# EAGLE design dsp (EAGLE 7.2.0)
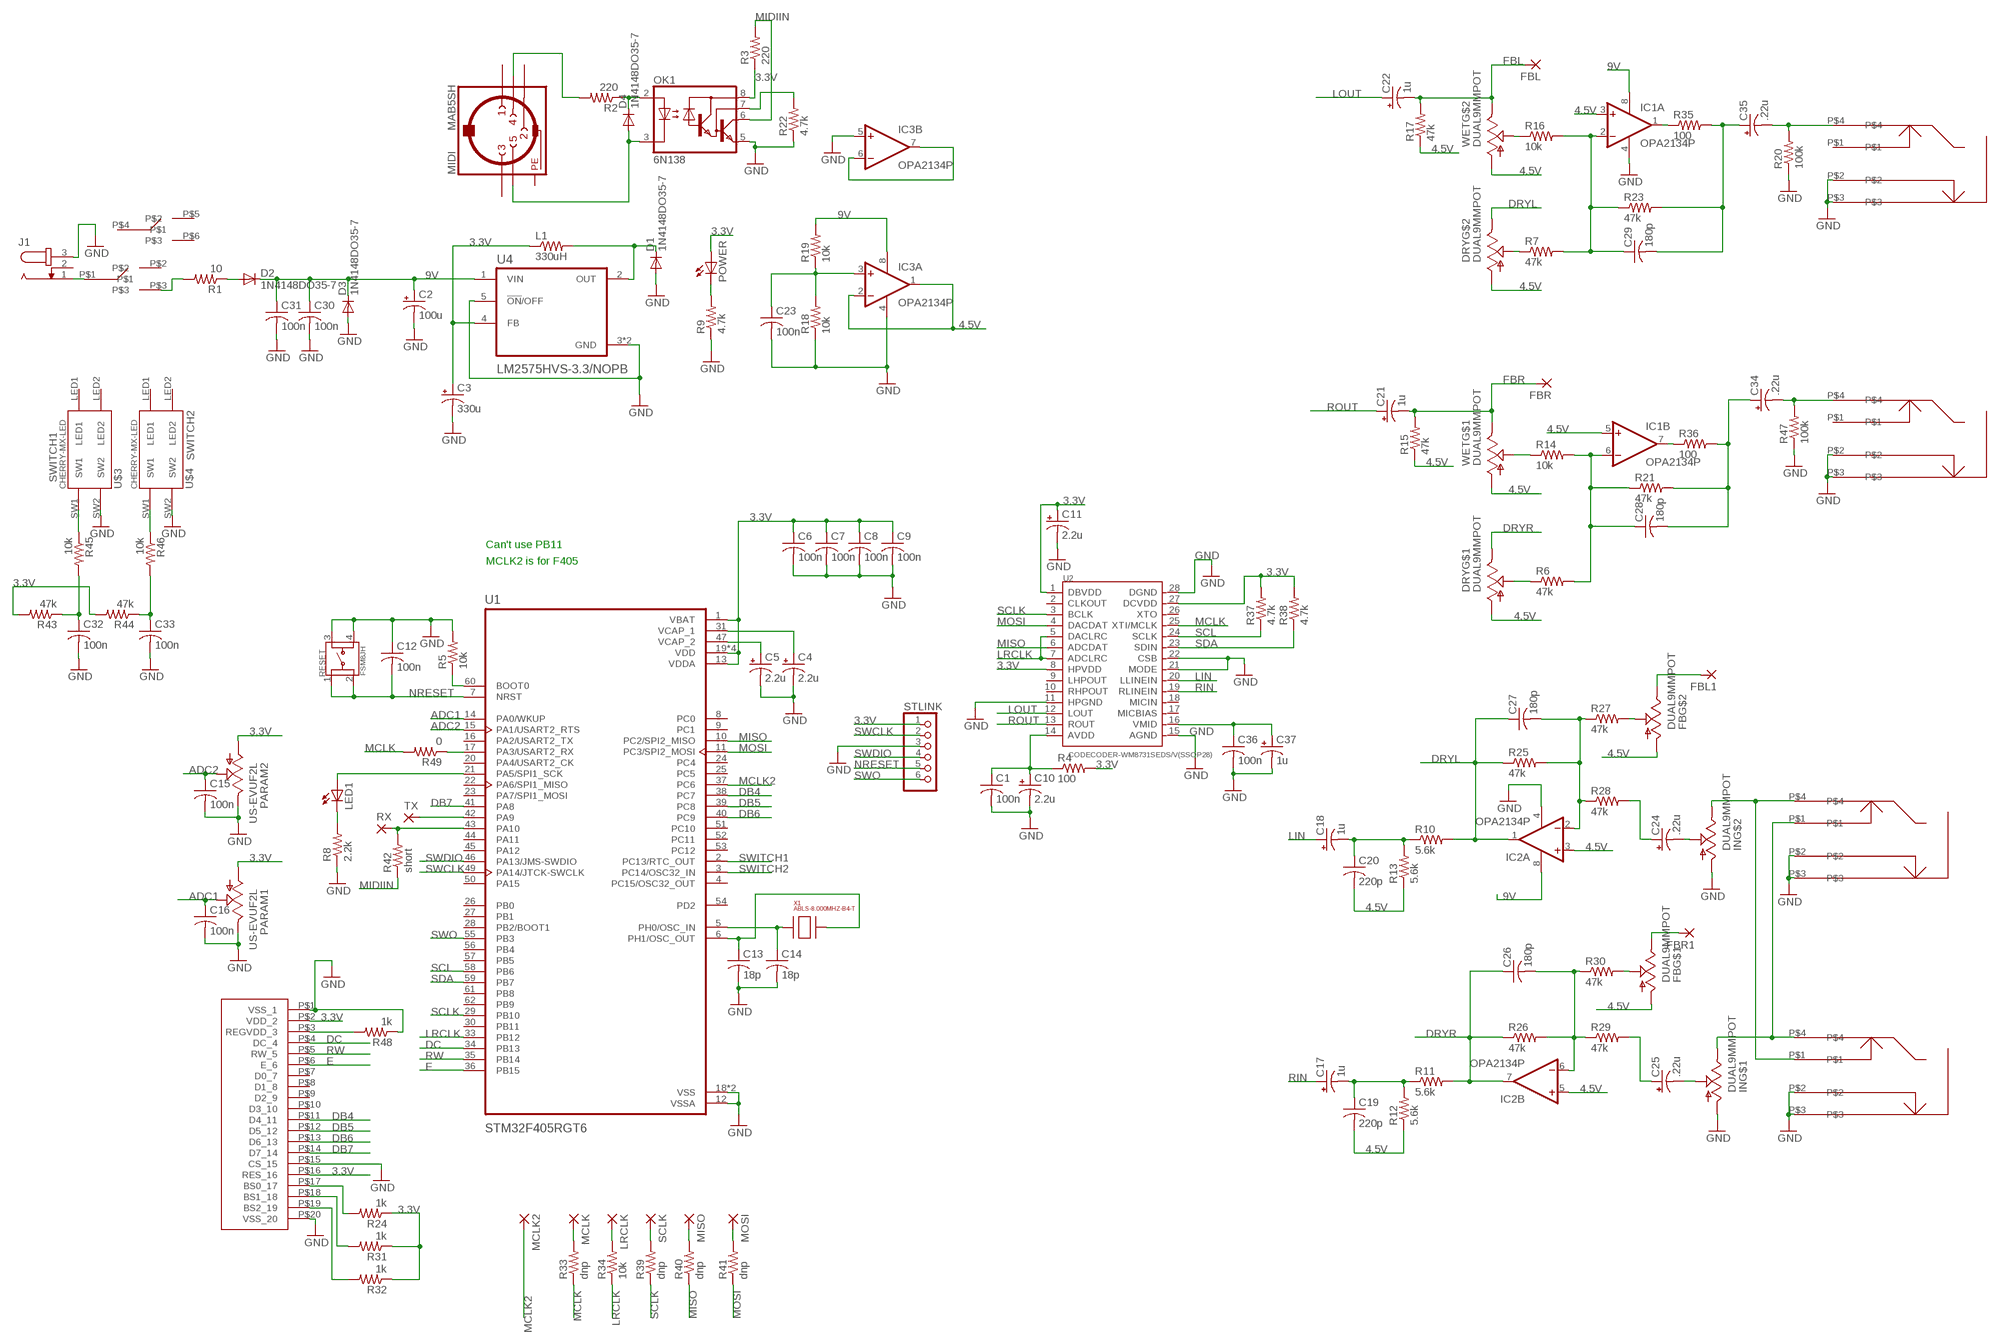
[diagram p0: schematic, sheet 1]

## Parts
C1  100n  C-US050-025X075  [C050-025X075]
C2  100u  CPOL-USE2.5-7  [E2,5-7]
C3  330u  CPOL-USE3.5-8  [E3,5-8]
C4  2.2u  CPOL-USE2-4  [E2-4]
C5  2.2u  CPOL-USE2-4  [E2-4]
C6  100n  C-US050-025X075  [C050-025X075]
C7  100n  C-US050-025X075  [C050-025X075]
C8  100n  C-US050-025X075  [C050-025X075]
C9  100n  C-US050-025X075  [C050-025X075]
C10  2.2u  CPOL-USE2-5  [E2-5]
C11  2.2u  CPOL-USE2-4  [E2-4]
C12  100n  C-US050-025X075  [C050-025X075]
C13  18p  C-USC0603  [C0603]
C14  18p  C-USC0603  [C0603]
C15  100n  C-US050-025X075  [C050-025X075]
C16  100n  C-US050-025X075  [C050-025X075]
C17  1u  CPOL-USE2.5-7  [E2,5-7]
C18  1u  CPOL-USE2.5-7  [E2,5-7]
C19  220p  C-US050-025X075  [C050-025X075]
C20  220p  C-US050-025X075  [C050-025X075]
C21  1u  CPOL-USE2.5-7  [E2,5-7]
C22  1u  CPOL-USE2.5-7  [E2,5-7]
C23  100n  C-US050-025X075  [C050-025X075]
C24  .22u  CPOL-USE2.5-7  [E2,5-7]
C25  .22u  CPOL-USE2.5-7  [E2,5-7]
C26  180p  C-US050-025X075  [C050-025X075]
C27  180p  C-US050-025X075  [C050-025X075]
C28  180p  C-US050-025X075  [C050-025X075]
C29  180p  C-US050-025X075  [C050-025X075]
C30  100n  C-US050-025X075  [C050-025X075]
C31  100n  C-US050-025X075  [C050-025X075]
C32  100n  C-US050-025X075  [C050-025X075]
C33  100n  C-US050-025X075  [C050-025X075]
C34  .22u  CPOL-USE2.5-7  [E2,5-7]
C35  .22u  CPOL-USE2.5-7  [E2,5-7]
C36  100n  C-US050-025X075  [C050-025X075]
C37  1u  CPOL-USE2-4  [E2-4]
D1  1N4148DO35-7  [DO35-7]
D2  1N4148DO35-7  [DO35-7]
D3  1N4148DO35-7  [DO35-7]
D4  1N4148DO35-7  [DO35-7]
DRY  DUAL9MMPOT  [DUAL9MMPOT]
FB  DUAL9MMPOT  [DUAL9MMPOT]
FBL  2,0/0,9-S  [2,0/0,9-S]
FBL1  2,0/0,9-S  [2,0/0,9-S]
FBR  2,0/0,9-S  [2,0/0,9-S]
FBR1  2,0/0,9-S  [2,0/0,9-S]
IC1  OPA2134P  [DIL08]
IC2  OPA2134P  [DIL08]
IC3  OPA2134P  [DIL08]
IN  DUAL9MMPOT  [DUAL9MMPOT]
INL  NMJ4HCD2  [NMJ4HCD2]
INR  NMJ4HCD2  [NMJ4HCD2]
J1  JACK-PLUG0  [SPC4077]
L1  330uH  R-US_0207/7  [0207/7]
LED1  LED5MM  [LED5MM]
LRCLK  2,0/0,9-S  [2,0/0,9-S]
MCLK  2,0/0,9-S  [2,0/0,9-S]
MCLK2  2,0/0,9-S  [2,0/0,9-S]
MIDI  MAB5SH  [MAB5SH]
MISO  2,0/0,9-S  [2,0/0,9-S]
MOSI  2,0/0,9-S  [2,0/0,9-S]
OK1  6N138  [DIL08]
OUTL  NMJ4HCD2  [NMJ4HCD2]
OUTR  NMJ4HCD2  [NMJ4HCD2]
PARAM1  US-EVUF2L  [EVUFXL]
PARAM2  US-EVUF2L  [EVUFXL]
POWER  LED5MM  [LED5MM]
R1  10  R-US_0309/V  [0309V]
R2  220  R-US_0309/V  [0309V]
R3  220  R-US_0309/V  [0309V]
R4  100  R-US_0309/V  [0309V]
R5  10k  R-US_R0603  [R0603]
R6  47k  R-US_0309/V  [0309V]
R7  47k  R-US_0309/V  [0309V]
R8  2.2k  R-US_0309/V  [0309V]
R9  4.7k  R-US_0309/V  [0309V]
R10  5.6k  R-US_0309/V  [0309V]
R11  5.6k  R-US_0309/V  [0309V]
R12  5.6k  R-US_0309/V  [0309V]
R13  5.6k  R-US_0309/V  [0309V]
R14  10k  R-US_0309/V  [0309V]
R15  47k  R-US_0309/V  [0309V]
R16  10k  R-US_0309/V  [0309V]
R17  47k  R-US_0309/V  [0309V]
R18  10k  R-US_0309/V  [0309V]
R19  10k  R-US_0309/V  [0309V]
R20  100k  R-US_0309/V  [0309V]
R21  47k  R-US_0309/V  [0309V]
R22  4.7k  R-US_0309/V  [0309V]
R23  47k  R-US_0309/V  [0309V]
R24  1k  R-US_0309/V  [0309V]
R25  47k  R-US_0309/V  [0309V]
R26  47k  R-US_0309/V  [0309V]
R27  47k  R-US_0309/V  [0309V]
R28  47k  R-US_0309/V  [0309V]
R29  47k  R-US_0309/V  [0309V]
R30  47k  R-US_0309/V  [0309V]
R31  1k  R-US_0309/V  [0309V]
R32  1k  R-US_0309/V  [0309V]
R33  dnp  R-US_R0603  [R0603]
R34  10k  R-US_R0603  [R0603]
R35  100  R-US_0309/V  [0309V]
R36  100  R-US_0309/V  [0309V]
R37  4.7k  R-US_R0603  [R0603]
R38  4.7k  R-US_R0603  [R0603]
R39  dnp  R-US_R0603  [R0603]
R40  dnp  R-US_R0603  [R0603]
R41  dnp  R-US_R0603  [R0603]
R42  short  R-US_0309/V  [0309V]
R43  47k  R-US_0309/V  [0309V]
R44  47k  R-US_0309/V  [0309V]
R45  10k  R-US_0309/V  [0309V]
R46  10k  R-US_0309/V  [0309V]
R47  100k  R-US_0309/V  [0309V]
R48  1k  R-US_0309/V  [0309V]
R49  0  R-US_R0603  [R0603]
RESET  FSM8JH  [SW_FSM8JH]
RX  2,0/0,9-S  [2,0/0,9-S]
SCLK  2,0/0,9-S  [2,0/0,9-S]
STLINK  PINHD-1X6  [1X06]
TX  2,0/0,9-S  [2,0/0,9-S]
U1  STM32F405RGT6  [QFP50P1200X1200X160-64N]
U2  CODECODER-WM8731SEDS/V(SSOP28)  [SSOP28-0.65-10.2X5.2MM]
U4  LM2575HVS-3.3/NOPB  [VREG_TPS79625KTTR]
U$1  NHD-0420CW  [NHD-0420CW]
U$2  LC2255  [LC2255]
U$3  CHERRY-MX-LED  [CHERRY-MX-LED]
U$4  CHERRY-MX-LED  [CHERRY-MX-LED]
WET  DUAL9MMPOT  [DUAL9MMPOT]
X1  ABLS-8.000MHZ-B4-T  [HC-49/US]

## Nets
3.3V: C3.+ C6.1 C7.1 C8.1 C9.1 C11.+ L1.1 OK1.8(VCC) PARAM1.1(A) PARAM2.1(A) POWER.A R3.1 R4.2 R24.1 R31.1 R32.1 R37.2 R38.2 R43.2 R44.2 STLINK.1 U1.1(VBAT) U1.13(VDDA) U1.19(VDD) U1.32(VDD) U1.48(VDD) U1.64(VDD) U2.1(DBVDD) U2.8(HPVDD) U2.27(DCVDD) U4.4(FB) U$1.P$2(VDD_2) U$1.P$16(RES_16)
4.5V: C19.2 C20.2 DRY.1(A) DRY.4(A) FB.1(A) FB.4(A) IC1.3(A:+IN) IC1.5(B:+IN) IC2.3(A:+IN) IC2.5(B:+IN) IC3.1(A:OUT) IC3.2(A:-IN) R12.1 R13.1 R15.1 R17.1 WET.1(A) WET.4(A)
9V: C2.+ C30.1 C31.1 D2.C D3.C IC1.8(P:V+) IC2.8(P:V+) IC3.8(P:V+) R19.2 U4.1(VIN)
ADC1: C16.1 PARAM1.2(S) U1.14(PA0/WKUP)
ADC2: C15.1 PARAM2.2(S) U1.15(PA1/USART2_RTS)
DB4: U1.38(PC7) U$1.P$11(D4_11)
DB5: U1.39(PC8) U$1.P$12(D5_12)
DB6: U1.40(PC9) U$1.P$13(D6_13)
DB7: U1.41(PA8) U$1.P$14(D7_14)
DC: U1.34(PB13) U$1.P$4(DC_4)
DRYL: C27.1 DRY.6(E) IC2.1(A:OUT) R10.2 R25.1
DRYR: C26.1 DRY.3(E) IC2.7(B:OUT) R11.2 R26.1
E: U1.36(PB15) U$1.P$6(E_6)
FBL: C22.- FBL.1(P) R17.2 WET.6(E)
FBR: C21.- FBR.1(P) R15.2 WET.3(E)
GND: C1.2 C2.- C3.- C4.- C5.- C6.2 C7.2 C8.2 C9.2 C10.- C11.- C12.1 C13.2 C14.2 C15.2 C16.2 C23.2 C30.2 C31.2 C32.2 C33.2 C36.2 C37.- D1.A D3.A IC1.4(P:V-) IC2.4(P:V-) IC3.4(P:V-) IC3.5(B:+IN) IN.1(A) IN.4(A) INL.P$2 INL.P$3 INR.P$2 INR.P$3 J1.3 OK1.5(GND) OUTL.P$2 OUTL.P$3 OUTR.P$2 OUTR.P$3 PARAM1.3(E) PARAM2.3(E) R5.2 R8.1 R9.1 R18.1 R20.1 R22.1 R47.1 R48.1 RESET.3 RESET.4 STLINK.3 U1.12(VSSA) U1.18(VSS) U1.63(VSS) U2.11(HPGND) U2.15(AGND) U2.21(MODE) U2.22(CSB) U2.28(DGND) U4.3(GND) U4.5(!ON!/OFF) U4.6(GND) U$1.P$1(VSS_1) U$1.P$15(CS_15) U$1.P$20(VSS_20) U$3.SW2 U$4.SW2
LIN: C18.+ U2.20(LLINEIN)
LOUT: C22.+ U2.12(LOUT)
LRCLK: R34.1 U1.33(PB12) U2.5(DACLRC) U2.7(ADCLRC)
MCLK: R33.1 R49.2 U2.25(XTI/MCLK)
MCLK2: MCLK2.1(P) U1.37(PC6)
MIDIIN: OK1.6(VO) R3.2 R42.1
MISO: R40.1 U1.10(PC2/SPI2_MISO) U2.6(ADCDAT)
MOSI: R41.1 U1.11(PC3/SPI2_MOSI) U2.4(DACDAT)
N$1: C4.+ U1.31(VCAP_1)
N$2: C5.+ U1.47(VCAP_2)
N$3: D2.A R1.1
N$4: D1.C L1.2 U4.2(OUT)
N$5: C1.1 C10.+ R4.1 U2.14(AVDD)
N$6: R1.2 U$2.P$3
N$7: R5.1 U1.60(BOOT0)
N$8: TX.1(P) U1.42(PA9)
N$9: LED1.A U1.21(PA5/SPI1_SCK)
N$10: LED1.K(C) R8.2
N$11: POWER.K(C) R9.2
N$12: C13.1 U1.6(PH1/OSC_OUT) X1.P$2
N$13: C14.1 U1.5(PH0/OSC_IN) X1.P$1
N$14: FB.2(S) R30.2
N$15: C17.- C19.1 R11.1 R12.2
N$16: FB.5(S) R27.2
N$17: C18.- C20.1 R10.1 R13.2
N$18: C29.1 IC1.2(A:-IN) R7.2 R16.2 R23.1
N$19: C28.1 IC1.6(B:-IN) R6.2 R14.2 R21.1
N$20: C23.1 IC3.3(A:+IN) R18.2 R19.1
N$21: R14.1 WET.2(S)
N$22: R16.1 WET.5(S)
N$23: C28.2 C34.+ R21.2 R36.2
N$24: C29.2 C35.+ R23.2 R35.2
N$25: R49.1 U1.17(PA3/USART2_RX)
N$26: C24.+ R28.2
N$27: C27.2 IC2.2(A:-IN) R25.2 R27.1 R28.1
N$28: C26.2 IC2.6(B:-IN) R26.2 R29.1 R30.1
N$29: IN.3(E) INL.P$1 INR.P$4
N$30: C25.+ R29.2
N$31: IC1.7(B:OUT) R36.1
N$32: IC1.1(A:OUT) R35.1
N$33: C24.- IN.5(S)
N$34: C25.- IN.2(S)
N$35: DRY.2(S) R6.1
N$36: DRY.5(S) R7.1
N$37: J1.1 U$2.P$1
N$38: OK1.7(VB) R22.2
N$39: D4.C OK1.2(A) R2.1
N$40: MIDI.4 R2.2
N$41: D4.A MIDI.5 OK1.3(C)
N$42: R32.2 U$1.P$19(BS2_19)
N$43: R31.2 U$1.P$18(BS1_18)
N$44: R24.2 U$1.P$17(BS0_17)
N$45: MCLK.1(P) R33.2
N$46: LRCLK.1(P) R34.2
N$47: R39.2 SCLK.1(P)
N$48: MISO.1(P) R40.2
N$49: MOSI.1(P) R41.2
N$50: R42.2 RX.1(P) U1.43(PA10)
N$51: R45.1 U$3.SW1
N$52: R46.1 U$4.SW1
N$53: C35.- OUTL.P$4 R20.2
N$54: C34.- OUTR.P$4 R47.2
N$55: FB.6(E) FBL1.1(P)
N$56: FB.3(E) FBR1.1(P)
N$57: C36.1 C37.+ U2.16(VMID)
N$58: IN.6(E) INL.P$4 INR.P$1
N$59: R48.2 U$1.P$3(REGVDD_3)
N$60: IC3.6(B:-IN) IC3.7(B:OUT)
NRESET: C12.2 RESET.1 RESET.2 STLINK.5 U1.7(NRST)
RIN: C17.+ U2.19(RLINEIN)
ROUT: C21.+ U2.13(ROUT)
RW: U1.35(PB14) U$1.P$5(RW_5)
SCL: R37.1 U1.58(PB6) U2.24(SCLK)
SCLK: R39.1 U1.29(PB10) U2.3(BCLK)
SDA: R38.1 U1.59(PB7) U2.23(SDIN)
SWCLK: STLINK.2 U1.49(PA14/JTCK-SWCLK)
SWDIO: STLINK.4 U1.46(PA13/JMS-SWDIO)
SWITCH1: C32.1 R43.1 R45.2 U1.2(PC13/RTC_OUT)
SWITCH2: C33.1 R44.1 R46.2 U1.3(PC14/OSC32_IN)
SWO: STLINK.6 U1.55(PB3)
Unconnected: J1.2 MIDI.1 MIDI.2 MIDI.3 OUTL.P$1 OUTR.P$1 U1.4(PC15/OSC32_OUT) U1.8(PC0) U1.9(PC1) U1.16(PA2/USART2_TX) U1.20(PA4/USART2_CK) U1.22(PA6/SPI1_MISO) U1.23(PA7/SPI1_MOSI) U1.24(PC4) U1.25(PC5) U1.26(PB0) U1.27(PB1) U1.28(PB2/BOOT1) U1.30(PB11) U1.44(PA11) U1.45(PA12) U1.50(PA15) U1.51(PC10) U1.52(PC11) U1.53(PC12) U1.54(PD2) U1.56(PB4) U1.57(PB5) U1.61(PB8) U1.62(PB9) U2.2(CLKOUT) U2.9(LHPOUT) U2.10(RHPOUT) U2.17(MICBIAS) U2.18(MICIN) U2.26(XTO) U$1.P$7(D0_7) U$1.P$8(D1_8) U$1.P$9(D2_9) U$1.P$10(D3_10) U$2.P$2 U$2.P$4 U$2.P$5 U$2.P$6 U$3.LED1 U$3.LED2 U$4.LED1 U$4.LED2

## Notes on the sheet
- Can't use PB11
- MCLK2 is for F405

## Power pins joined to a net without a drawn wire
PE: MIDI.PE MIDI.PE@(PE)

## Library data of the parts
C1 C6-C9 C12-C16 C19 C20 C23 C26-C33 C36 = dan:C-US: CAPACITOR, American symbol
C2-C5 C10 C11 C17 C18 C21 C22 C24 C25 C34 C35 C37 = dan:CPOL-US: POLARIZED CAPACITOR, American symbol
D1-D4 = dan:1N4148: DIODE high speed (Philips)
DRY FB IN WET = dan:DUAL9MMPOT
FBL FBL1 FBR FBR1 LRCLK MCLK MCLK2 MISO MOSI RX SCLK TX = synthdiy:2,0/0,9-S: SQUARE THROUGH-HOLE PAD 2.0 mm, 0.9 mm/0.079",0.035"
IC1-IC3 = dan:OPA2134: SoundPLUS (TM) High Performance AUDIO OPERATIONAL AMPLIFIERS Source: http://focus.ti.com/lit/ds/sbos058/sbos058.pdf
INL INR OUTL OUTR = dan:NMJ4HCD2
J1 = dan:JACK-PLUG: DC POWER JACK Power Jack, DC, Right Angle, Through Hole, Rated 5A at 16VDC, PC Terminals Distributor: Farnell (www.Farnell.de) Drawing: 84N1161.pdf / 84N1162.pdf Manufacturer: SPC Technology (www.spctechnology.com) Type: SPC4077 / SPC 4078; OC_FARNELL: unknown; OC_NEWARK: unknown
L1 R1-R49 = dan:R-US_: RESISTOR, American symbol
LED1 POWER = dan:LED: LED OSRAM: - CHIPLED LG R971, LG N971, LY N971, LG Q971, LY Q971, LO R971, LY R971 LH N974, LH R974 LS Q976, LO Q976, LY Q976 LO Q996 - Hyper CHIPLED LW Q18S LB Q993, LB Q99A, LB R99A - SideLED LS A670, LO A670, LY A670, LG A670, LP A670 LB A673, LV A673, LT A673, LW A673 LH A674 LY A675 LS A676, LA A676, LO A676, LY A676, LW A676 LS A679, LY A679, LG A679 - Hyper Micro SIDELED® LS Y876, LA Y876, LO Y876, LY Y876 LT Y87S - SmartLED LW L88C, LW L88S LB L89C, LB L89S, LG L890 LS L89K, LO L89K, LY L89K LS L896, LA L896, LO L896, LY L896 - TOPLED LS T670, LO T670, LY T670, LG T670, LP T670 LSG T670, LSP T670, LSY T670, LOP T670, LYG T670 LG T671, LOG T671, LSG T671 LB T673, LV T673, LT T673, LW T673 LH T674 LS T676, LA T676, LO T676, LY T676, LB T676, LH T676, LSB T676, LW T676 LB T67C, LV T67C, LT T67C, LS T67K, LO T67K, LY T67K, LW E67C LS E67B, LA E67B, LO E67B, LY E67B, LB E67C, LV E67C, LT E67C LW T67C LS T679, LY T679, LG T679 LS T770, LO T770, LY T770, LG T770, LP T770 LB T773, LV T773, LT T773, LW T773 LH T774 LS E675, LA E675, LY E675, LS T675 LS T776, LA T776, LO T776, LY T776, LB T776 LHGB T686 LT T68C, LB T68C - Hyper Mini TOPLED® LB M676 - Mini TOPLED Santana® LG M470 LS M47K, LO M47K, LY M47K Source: http://www.osram.convergy.de LUXEON: - LUMILED® LXK2-PW12-R00, LXK2-PW12-S00, LXK2-PW14-U00, LXK2-PW14-V00 LXK2-PM12-R00, LXK2-PM12-S00, LXK2-PM14-U00 LXK2-PE12-Q00, LXK2-PE12-R00, LXK2-PE12-S00, LXK2-PE14-T00, LXK2-PE14-U00 LXK2-PB12-K00, LXK2-PB12-L00, LXK2-PB12-M00, LXK2-PB14-N00, LXK2-PB14-P00, LXK2-PB14-Q00 LXK2-PR12-L00, LXK2-PR12-M00, LXK2-PR14-Q00, LXK2-PR14-R00 LXK2-PD12-Q00, LXK2-PD12-R00, LXK2-PD12-S00 LXK2-PH12-R00, LXK2-PH12-S00 LXK2-PL12-P00, LXK2-PL12-Q00, LXK2-PL12-R00 Source: www.luxeon.com KINGBRIGHT: KA-3528ASYC Source: www.kingbright.com
MIDI = dan:MAB5SH: Female CONNECTOR 5 pins 90 deg. with shield, horizontal (DIN 41524); OC_FARNELL: 809883; OC_NEWARK: unknown
OK1 = dan:6N138: MOTOROLA OPTO COUPLER; MF: VISHAY/TELEFUNKEN; MPN: 6N138; OC_FARNELL: 9860150; OC_NEWARK: 35K5294
PARAM1 PARAM2 = dan:US-EVU: 9 mm Square Rotary Potentiometers Source: Panasonic
RESET = FSM8JH:FSM8JH: Switch, Pushbutton, Tactile, SPST, Thru Hole, Vertical, 6MM, Black Check prices <https://pricing.snapeda.com/parts/FSM8JH/TE%20Connectivity/view-part?ref=eda>; AVAILABILITY: Warning; DESCRIPTION: Tactile Switch SPST-NO Top Actuated Through Hole; MF: TE Connectivity; MP: FSM8JH; PACKAGE: None; PRICE: None
STLINK = dan:PINHD-1X6: PIN HEADER
U1 = STM32F405RGT6:STM32F405RGT6: High-performance foundation line, ARM Cortex-M4 core with DSP and FPU, 1 Mbyte Flash, 168 MHz CPU, ART Accelerator Check prices <https://pricing.snapeda.com/parts/STM32F405RGT6/STMicroelectronics/view-part?ref=eda>; AVAILABILITY: Good; DESCRIPTION: ARM® Cortex®-M4 STM32F4 Microcontroller IC 32-Bit 168MHz 1MB (1M x 8) FLASH 64-LQFP (10x10); MF: STMicroelectronics; MP: STM32F405RGT6; PACKAGE: LQFP-64 STMicroelectronics; PRICE: None; PURCHASE-URL: https://pricing.snapeda.com/search/part/STM32F405RGT6/?ref=eda
U2 = CODECODER-WM8731SEDS_V_SSOP28_:CODECODER-WM8731SEDS/V(SSOP28): 310080003 Check prices <https://pricing.snapeda.com/parts/WM8731SEDS/V/Cirrus%20Logic/view-part?ref=eda>; AVAILABILITY: Warning; DESCRIPTION: Audio Interface 24 b Serial 28-SSOP; MF: Cirrus Logic; MP: WM8731SEDS/V; PACKAGE: SSOP-28 Cirrus Logic; PRICE: None; PURCHASE-URL: https://pricing.snapeda.com/search/part/WM8731SEDS/V/?ref=eda
U4 = LM2575HVS-3.3_NOPB:LM2575HVS-3.3/NOPB: Check prices <https://pricing.snapeda.com/parts/LM2575HVS-3.3/NOPB/Texas%20Instruments/view-part?ref=eda>; AVAILABILITY: Good; DESCRIPTION: SIMPLE SWITCHER 1A Step-Down Voltage Regulator 5-DDPAK/TO-263 -40 to 125; MF: Texas Instruments; MP: LM2575HVS-3.3/NOPB; PACKAGE: TO-263-5 Texas Instruments; PRICE: None; PURCHASE-URL: https://pricing.snapeda.com/search/part/LM2575HVS-3.3/NOPB/?ref=eda
U$1 = dan:NHD-0420CW
U$2 = dan:LC2255
U$3 U$4 = dan:CHERRY-MX-LED: Cherry MX series keyswitch with LED
X1 = ABLS-8.000MHZ-B4-T:ABLS-8.000MHZ-B4-T: 8MHz ±30ppm Crystal 18pF 80 Ohms HC-49/US Check prices <https://pricing.snapeda.com/parts/ABLS-8.000MHZ-B4-T/Abracon%20LLC/view-part?ref=eda>; AVAILABILITY: Good; DESCRIPTION: 8MHz ±30ppm Crystal 18pF 80 Ohms HC-49/US; MF: Abracon LLC; MP: ABLS-8.000MHZ-B4-T; PACKAGE: HC-49/US Abracon LLC; PRICE: None; PURCHASE-URL: https://pricing.snapeda.com/search/part/ABLS-8.000MHZ-B4-T/?ref=eda

## Board
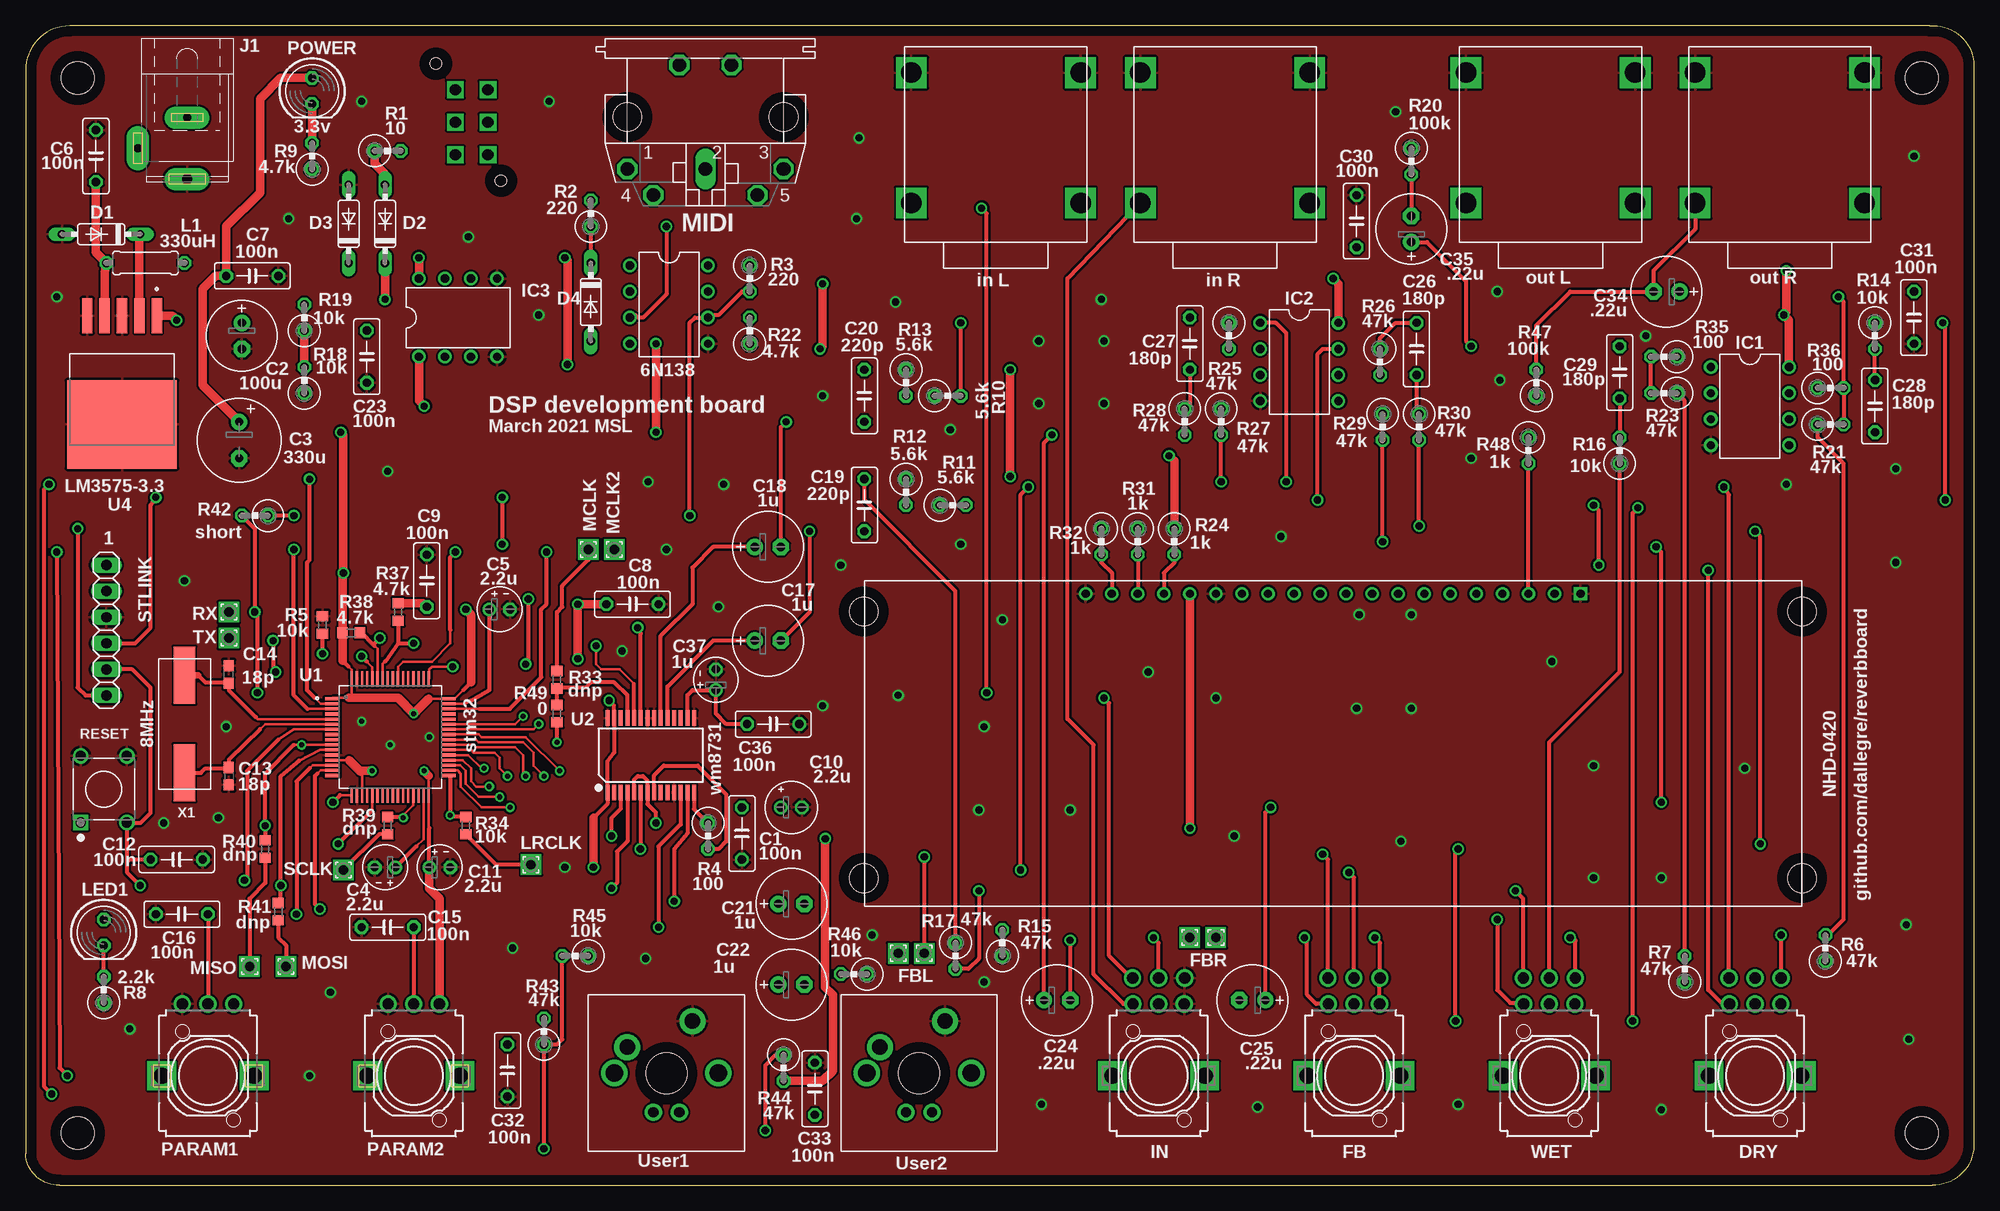
[diagram p1: board, top side]
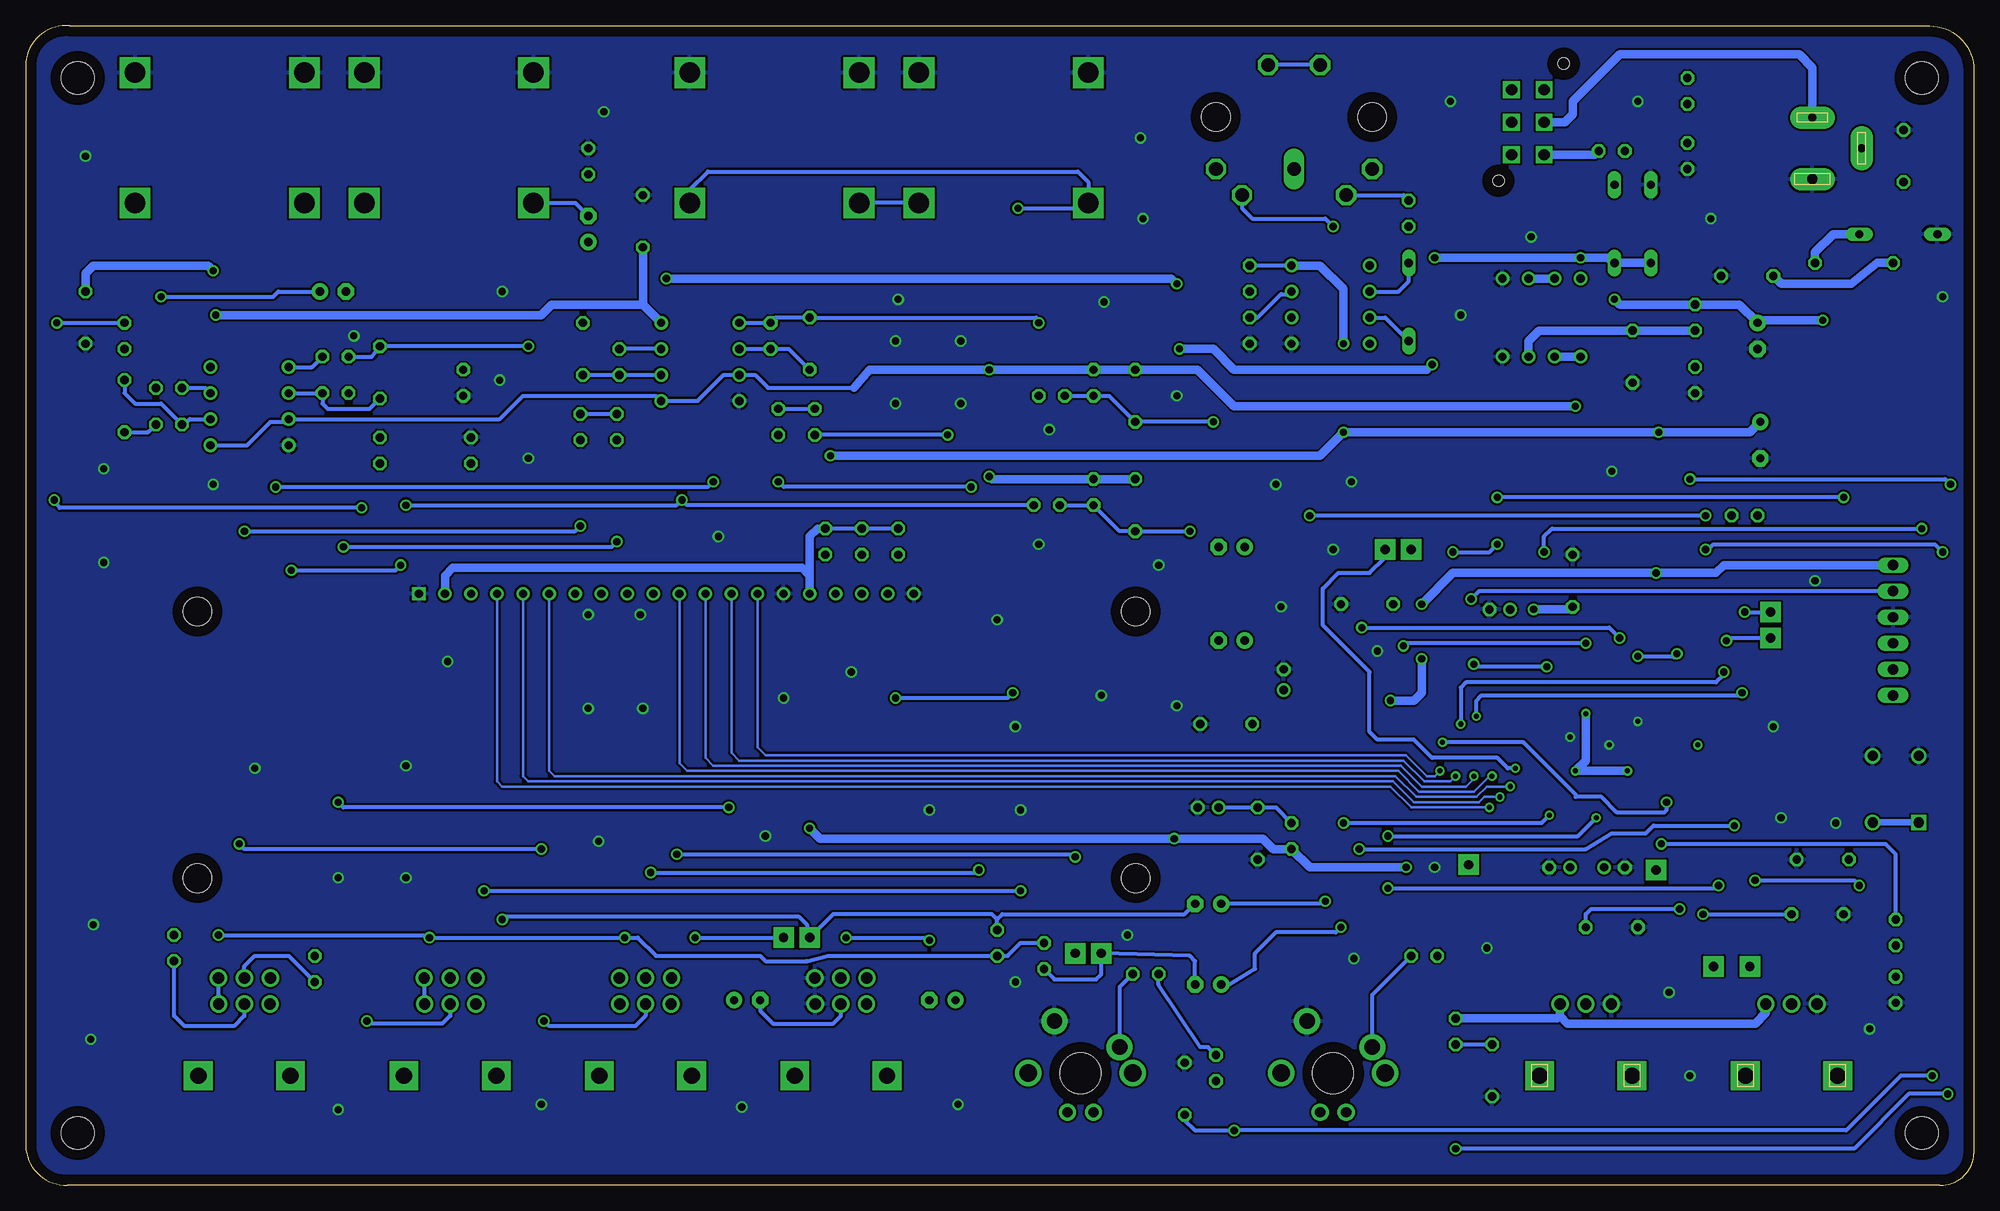
[diagram p2: board, bottom side, seen from below]

Size 189.99 x 113.05 mm. Coordinates in mm from the lower left corner, seen from the top.
Outline: 3.3,0 185.93,0 arc90 189.99,3.81 189.99,109.47 arc90 185.67,113.03 4.32,113.03 arc90 0,108.71 0,3.05 arc90 3.3,0
Copper layers (1*16): Top 0.035mm / dielectric 1.5mm / Bottom 0.035mm
Design rules "default *": minimum track width 10mil, minimum drill 10mil, track to track 8mil, track to pad 8mil, pad to pad 8mil, via to via 8mil, smd to smd 8mil, copper to edge 40mil, drill to drill 8mil, minimum pad ring 10mil, minimum via ring 8mil, stop-mask expansion 4mil, vias tented up to drill 0mil, thermal gap 10mil
Holes 3.2 mm at 5.08,107.95 5.08,5.08 184.91,5.08 184.91,107.95

### Footprints (pad centres in the part's own frame; a part is rotated, then mirrored left to right if it is on the bottom)
C050-025X075 = drill 0.813 octagon: 1 -2.54,0; 2 2.54,0
E2,5-7 = drill 0.813 pad 1.6: + -1.27,0 | drill 0.813 pad 1.6 octagon: - 1.27,0
E3,5-8 = drill 0.813 pad 1.6: + -1.778,0 | drill 0.813 pad 1.6 octagon: - 1.778,0
E2-4 = drill 0.813 pad 1.27: + -1.016,0 | drill 0.813 pad 1.27 octagon: - 1.016,0
E2-5 = drill 0.813 pad 1.27: + -1.016,0 | drill 0.813 pad 1.27 octagon: - 1.016,0
C0603 = smd 1.1 x 1: 1 -0.85,0; 2 0.85,0
DO35-7 = drill 0.813 long: A 3.81,0; C -3.81,0
DUAL9MMPOT = drill 1.1 pad 1.676: 1 -2.5,-7; 2 0,-7; 3 2.5,-7; 4 -2.54,-9.525; 5 0,-9.525; 6 2.54,-9.525 | drill 1.6 pad 2.8 square: M1 4.5,0; M2 -4.5,0
2,0/0,9-S = drill 0.914 pad 2 square: 1 0,0
DIL08 = drill 0.813 pad 1.27: 1 -3.81,-3.81; 2 -1.27,-3.81; 3 1.27,-3.81; 4 3.81,-3.81; 5 3.81,3.81; 6 1.27,3.81; 7 -1.27,3.81; 8 -3.81,3.81
NMJ4HCD2 = drill 2 square: P$1 0,0; P$2 12.7,0; P$3 12.7,16.51; P$4 0,16.51
SPC4077 = drill 0.8 pad 2.184 long: 1 -3,0; 2 0,-4.8 | drill 1 pad 2.184 long: 3 3,0
0207/7 = drill 0.813 octagon: 1 -3.81,0; 2 3.81,0
LED5MM = drill 0.813 octagon: A -1.27,0; K 1.27,0
MAB5SH = drill 1.321 octagon: 1 7.62,5.08; 3 -7.62,5.08; 4 5.08,7.62; 5 -5.08,7.62; PE -2.54,-5.08; PE@ 2.54,-5.08 | drill 1.321 long: 2 0,5.08 | hole 2.794: 7.62,0; -7.62,0
EVUFXL = drill 1.1 pad 1.676: 1 -2.5,-7; 2 0,-7; 3 2.5,-7 | drill 1.6 pad 2.8 square: M1 4.5,0; M2 -4.5,0
0309V = drill 0.813 octagon: 1 -1.27,0; 2 1.27,0
R0603 = smd 1 x 1.1: 1 -0.85,0; 2 0.85,0
SW_FSM8JH = drill 0.99 square: 1 -3.25,2.25 | drill 0.99: 2 -3.25,-2.25; 3 3.25,2.25; 4 3.25,-2.25
1X06 = drill 1.016 long: 1 -6.35,0; 2 -3.81,0; 3 -1.27,0; 4 1.27,0; 5 3.81,0; 6 6.35,0
QFP50P1200X1200X160-64N = smd 1.47 x 0.28: 1 -5.67,3.75; 2 -5.67,3.25; 3 -5.67,2.75; 4 -5.67,2.25; 5 -5.67,1.75; 6 -5.67,1.25; 7 -5.67,0.75; 8 -5.67,0.25; 9 -5.67,-0.25; 10 -5.67,-0.75; 11 -5.67,-1.25; 12 -5.67,-1.75; 13 -5.67,-2.25; 14 -5.67,-2.75; 15 -5.67,-3.25; 16 -5.67,-3.75; 33 5.67,-3.75; 34 5.67,-3.25; 35 5.67,-2.75; 36 5.67,-2.25; 37 5.67,-1.75; 38 5.67,-1.25; 39 5.67,-0.75; 40 5.67,-0.25; 41 5.67,0.25; 42 5.67,0.75; 43 5.67,1.25; 44 5.67,1.75; 45 5.67,2.25; 46 5.67,2.75; 47 5.67,3.25; 48 5.67,3.75 | smd 0.28 x 1.47: 17 -3.75,-5.67; 18 -3.25,-5.67; 19 -2.75,-5.67; 20 -2.25,-5.67; 21 -1.75,-5.67; 22 -1.25,-5.67; 23 -0.75,-5.67; 24 -0.25,-5.67; 25 0.25,-5.67; 26 0.75,-5.67; 27 1.25,-5.67; 28 1.75,-5.67; 29 2.25,-5.67; 30 2.75,-5.67; 31 3.25,-5.67; 32 3.75,-5.67; 49 3.75,5.67; 50 3.25,5.67; 51 2.75,5.67; 52 2.25,5.67; 53 1.75,5.67; 54 1.25,5.67; 55 0.75,5.67; 56 0.25,5.67; 57 -0.25,5.67; 58 -0.75,5.67; 59 -1.25,5.67; 60 -1.75,5.67; 61 -2.25,5.67; 62 -2.75,5.67; 63 -3.25,5.67; 64 -3.75,5.67
SSOP28-0.65-10.2X5.2MM = smd 0.4 x 1.5: 1 -4.225,-3.625; 2 -3.575,-3.625; 3 -2.925,-3.625; 4 -2.275,-3.625; 5 -1.625,-3.625; 6 -0.975,-3.625; 7 -0.325,-3.625; 8 0.325,-3.625; 9 0.975,-3.625; 10 1.625,-3.625; 11 2.275,-3.625; 12 2.925,-3.625; 13 3.575,-3.625; 14 4.225,-3.625; 15 4.225,3.625; 16 3.575,3.625; 17 2.925,3.625; 18 2.275,3.625; 19 1.625,3.625; 20 0.975,3.625; 21 0.325,3.625; 22 -0.325,3.625; 23 -0.975,3.625; 24 -1.625,3.625; 25 -2.275,3.625; 26 -2.925,3.625; 27 -3.575,3.625; 28 -4.225,3.625
VREG_TPS79625KTTR = smd 3.4 x 1: 1 -10.6,3.4; 2 -10.6,1.7; 3 -10.6,0; 4 -10.6,-1.7; 5 -10.6,-3.4 | smd 8.6 x 10.7: 6 0,0
NHD-0420CW = drill 0.8 square: P$1 -21.59,-1.27 | drill 0.8: P$2 -24.13,-1.27; P$3 -26.67,-1.27; P$4 -29.21,-1.27; P$5 -31.75,-1.27; P$6 -34.29,-1.27; P$7 -36.83,-1.27; P$8 -39.37,-1.27; P$9 -41.91,-1.27; P$10 -44.45,-1.27; P$11 -46.99,-1.27; P$12 -49.53,-1.27; P$13 -52.07,-1.27; P$14 -54.61,-1.27; P$15 -57.15,-1.27; P$16 -59.69,-1.27; P$17 -62.23,-1.27; P$18 -64.77,-1.27; P$19 -67.31,-1.27; P$20 -69.85,-1.27 | hole 2.8: 0,-3; 0,-29; -91.5,-3; -91.5,-29
LC2255 = drill 1.1 square: P$1 0,1.27; P$2 3.175,1.27; P$3 -3.175,1.27; P$4 0,-1.905; P$5 3.175,-1.905; P$6 -3.175,-1.905 | hole 1.1: 5.715,3.175; -5.715,-3.175
CHERRY-MX-LED = drill 1.016 pad 1.676: LED1 -1.27,-3.81; LED2 1.27,-3.81 | drill 1.714 pad 1.93: P$3 -5.08,0; P$4 5.08,0 | drill 1.5 pad 2.54: SW1 -3.81,2.54; SW2 2.54,5.08 | hole 4: 0,0
HC-49/US = smd 5.588 x 2.108: P$1 4.75,0; P$2 -4.75,0

### Placement (x,y rotation side)
C1  69.85,34.29 270 top
C2  21.08,82.8 270 top
C3  20.83,72.64 270 top
C4  35.05,30.99 180 top
C5  46.23,56.13 0 top
C6  6.86,100.33 90 top
C7  22.1,88.65 0 top
C8  59.18,56.64 0 top
C9  39.12,58.93 90 top
C10  74.68,36.83 0 top
C11  40.39,30.99 0 top
C12  14.73,31.75 180 top
C13  19.81,39.88 270 top
C14  19.81,49.78 90 top
C15  35.31,25.15 180 top
C16  15.24,26.42 180 top
C17  72.39,53.09 0 top
C18  72.39,62.23 0 top
C19  81.79,66.29 90 top
C20  81.79,76.96 90 top
C21  74.68,27.43 0 top
C22  74.68,19.56 0 top
C23  33.27,80.77 270 top
C24  100.58,18.03 0 top
C25  119.63,18.03 180 top
C26  135.64,81.53 270 top
C27  113.54,82.04 270 top
C28  180.34,75.95 270 top
C29  155.45,79.25 90 top
C30  129.79,93.98 90 top
C31  184.15,84.58 270 top
C32  46.99,11.18 270 top
C33  76.96,9.4 90 top
C34  160.02,87.12 180 top
C35  135.13,93.22 90 top
C36  72.9,44.96 0 top
C37  67.31,49.28 90 top
D1  7.37,92.71 180 top
D2  35.05,93.73 90 top
D3  31.5,93.73 90 top
D4  55.12,86.11 270 top
DRY  168.66,10.67 180 top
FB  129.54,10.67 180 top
FBL  85.09,22.61 0 top
FBL1  87.63,22.61 0 top
FBR  113.54,24.13 0 top
FBR1  116.08,24.13 0 top
IC1  168.15,75.95 270 top
IC2  124.21,80.26 270 top
IC3  42.16,84.58 0 top
IN  110.49,10.67 180 top
INL  102.87,95.76 90 top
INR  125.22,95.76 90 top
J1  15.75,101.09 270 top
L1  11.68,89.92 0 top
LED1  7.62,24.64 270 top
LRCLK  49.28,31.24 0 top
MCLK  54.86,61.98 90 top
MCLK2  57.4,61.98 0 top
MIDI  66.29,104.14 180 top
MISO  21.84,21.34 0 top
MOSI  25.4,21.34 0 top
OK1  62.74,85.85 270 top
OUTL  156.97,95.76 90 top
OUTR  179.32,95.76 90 top
PARAM1  17.78,10.67 180 top
PARAM2  37.85,10.67 180 top
POWER  27.94,106.68 270 top
R1  35.31,100.84 0 top
R2  55.12,94.74 90 top
R3  70.61,88.39 270 top
R4  66.55,34.04 270 top
R5  28.96,54.61 90 top
R6  175.51,23.11 90 top
R7  161.8,21.08 90 top
R8  7.62,19.05 90 top
R9  27.94,100.33 90 top
R10  89.92,76.96 0 top
R11  90.42,66.29 0 top
R12  85.85,67.56 270 top
R13  85.85,78.23 270 top
R14  180.34,82.8 270 top
R15  95.25,23.62 90 top
R16  155.45,71.63 90 top
R17  90.68,22.35 270 top
R18  27.18,78.49 90 top
R19  27.18,84.58 90 top
R20  135.13,99.82 270 top
R21  176.02,74.17 0 top
R22  70.61,83.31 90 top
R23  159.77,77.22 180 top
R24  112.01,62.74 270 top
R25  117.35,82.8 270 top
R26  132.08,80.26 270 top
R27  116.59,74.42 270 top
R28  113.03,74.42 270 top
R29  132.33,73.91 270 top
R30  135.89,73.91 270 top
R31  108.46,62.74 270 top
R32  104.9,62.74 270 top
R33  51.82,49.28 90 top
R34  42.93,35.05 270 top
R35  159.77,80.77 180 top
R36  176.02,77.72 0 top
R37  36.32,55.88 90 top
R38  31.75,53.85 180 top
R39  35.31,35.05 270 top
R40  23.37,32.77 270 top
R41  24.64,26.67 270 top
R42  22.35,65.28 180 top
R43  50.55,14.99 90 top
R44  73.91,11.43 270 top
R45  53.59,22.35 180 top
R46  80.77,20.57 180 top
R47  147.32,78.23 90 top
R48  146.56,71.63 270 top
R49  51.82,45.97 90 top
RESET  7.62,38.61 90 top
RX  19.81,55.88 0 top
SCLK  30.99,30.73 0 top
STLINK  7.87,54.1 270 top
TX  19.81,53.34 0 top
U1  35.56,43.69 0 top
U2  60.96,41.91 0 top
U4  9.4,74.17 270 top
U$1  173.23,58.93 0 top
U$2  43.18,103.63 90 top
U$3  62.48,10.92 0 top
U$4  87.12,10.92 0 top
WET  148.59,10.67 180 top
X1  15.49,44.96 90 top

### Tracks (layer width: path | path; a pad name or v marks a point on that pad's centre or on a via)
3.3V  (via drill 0.5, 0.7)
  Top 0.254: U1.13 31.53,41.44 | U1.1 29.95,47.5 31.5,47.5 31.81,47.81 U1.64 31.81,50.23 31.5,50.55 | U1.19 32.81,40.16 32.67,40.3 32.77,40.39 | 39.31,39.94 U1.32 39.31,34.86 39.37,34.8 | 42.67,48.26 41.85,47.44 U1.48 39.31,47.44
  Top 0.406: 30.9,51.14 31.5,50.55 | 42.67,48.26 43.43,49.02 | v56.9,47.24 57.38,46.76 U2.27 57.38,42.15 57.4,42.16 56.73,41.31 U2.1 56.73,37.18 55.37,35.81 | C11.+ 39.37,34.8 | 40.39,17.96 PARAM2.1 | U2.8 61.28,39.95 62.23,40.89 65.53,40.89 68.33,38.1 68.33,33.53 67.56,32.77 R4.2
  Top 0.813: 32.67,40.3 31.53,41.44 | 39.31,39.94 v38.86,40.39 | v33.78,40.39 32.77,40.39 | 39.31,47.44 v37.85,45.97 36.32,47.5 31.5,47.5 | 30.9,51.14 R38.2 30.9,59.35 v30.99,59.69 30.99,73.15 v30.73,73.41 | 43.43,49.02 43.43,55.63 v42.93,56.13 | v55.37,30.99 55.37,35.81 | C8.1 v53.85,56.64 v53.85,51.31 | U4.4 7.7,88.98 L1.1 6.86,90.93 C6.1 | C3.+ 17.27,77.98 17.27,87.38 18.54,88.65 C7.1 19.56,93.47 22.86,96.77 22.86,105.92 24.89,107.95 POWER.A | U$1.P$16 v113.54,34.8 | v61.47,82.04 v61.47,73.41 | C11.+ 39.37,28.96 40.39,27.94 40.39,17.96 | R37.2 38.77,56.73 C9.1 | 112.01,70.61 R24.1 | R44.2 77.72,10.16 78.74,11.18 78.74,18.54 77.98,19.3 v77.98,33.78
  Bottom 0.406: R32.1 R31.1 R24.1 | OK1.8 R3.1 | 40.39,17.88 PARAM2.1
  Bottom 0.813: v33.78,40.39 v38.86,40.39 37.85,41.4 v37.85,45.97 | v53.85,56.64 50.8,59.69 v30.99,59.69 25.15,59.69 24.38,60.45 STLINK.1 | L1.1 9.4,89.92 11.94,87.88 18.8,87.88 C7.1 | v113.54,34.8 112.52,33.78 v77.98,33.78 69.34,33.78 68.33,32.77 R4.2 64.77,30.99 v55.37,30.99 | U$1.P$2 149.1,59.44 148.34,60.2 114.3,60.2 113.54,59.44 | v56.9,47.24 54.61,47.24 53.85,48.01 v53.85,51.31 | C3.+ 21.84,73.41 v30.73,73.41 v61.47,73.41 63.75,71.12 v111.51,71.12 | OK1.8 63.75,89.66 61.47,87.38 v61.47,82.04 | PARAM1.1 20.28,16.8 21.34,15.75 39.62,15.75 40.39,16.51 | 40.39,16.51 40.39,17.88 | v42.93,56.13 39.37,56.13 C9.1 | R24.1 112.78,64.01 113.54,63.25 113.54,59.44 | 113.54,59.44 U$1.P$16 | R43.2 40.64,16.26 40.39,16.51
4.5V  (via drill 0.7)
  Top 0.406: FB.1 132.04,20.15 FB.4 132.08,23.62 v131.57,24.13 | R17.1 90.68,57.91 81.79,66.8 C19.2 | WET.4 151.13,23.88 v150.62,24.13 | DRY.4 v171.2,24.38
  Top 0.813: v96.01,69.09 v96.01,79.5 | IC3.1 38.35,76.45 v38.86,75.95
  Bottom 0.406: 109.22,77.72 117.6,77.72 118.87,78.99 IC2.3 121.92,78.99 124.46,76.45 IC2.5 128.52,76.96 141.48,76.96 143.76,74.68 IC1.3 164.59,74.42 166.12,74.42 168.4,72.14 IC1.5 | R17.1 92.96,23.62 94.23,22.35 R15.1 111.76,22.35 113.79,21.84 117.86,21.84 118.36,22.35 128.52,22.35 130.3,24.13 v131.57,24.13 v150.62,24.13 150.88,24.38 v171.2,24.38 | DRY.1 171.16,20.15 DRY.4 | WET.1 151.09,20.15 WET.4
  Bottom 0.813: C19.2 R12.1 95.76,68.83 v96.01,69.09 | v38.86,75.95 72.14,75.95 75.69,79.5 C20.2 R13.1 v96.01,79.5 107.7,79.5 109.22,77.72 | IC3.2 IC3.1
9V  (via drill 0.7)
  Top 0.61: 171.7,85.09 v171.45,84.84
  Top 0.813: U4.1 14.29,84.77 v14.73,84.33 | D2.C v35.05,86.36 | IC1.8 171.96,84.33 v171.45,84.84 | v171.7,89.15 171.7,85.09 | IC2.8 128.02,87.88 v127.51,88.39 | v77.72,87.88 77.72,81.79 v77.47,81.53 | v52.83,80.01 52.83,90.17 v52.58,90.42 | IC3.8 v38.35,90.42
  Bottom 0.61: 53.34,79.5 v52.83,80.01
  Bottom 0.813: D3.C D2.C 35.81,90.42 v38.35,90.42 v52.58,90.42 | v14.73,84.33 20.83,84.33 C2.+ 22.86,85.85 R19.2 34.54,85.85 v35.05,86.36 | v171.45,84.84 139.7,84.84 138.68,85.85 129.79,85.85 | 129.79,85.85 IC2.8 | C30.1 129.79,85.85 | C31.1 184.15,88.9 183.39,89.66 172.21,89.66 v171.7,89.15 | v127.51,88.39 78.23,88.39 v77.72,87.88 | v77.47,81.53 74.17,81.53 72.14,79.5 53.34,79.5
ADC1  (via drill 0.7)
  Top 0.254: U1.14 27.98,40.94 27.73,40.68
  Top 0.406: 27.73,40.68 26.42,39.37 26.42,26.67 | C16.1 PARAM1.2
  Top 0.61: 26.42,26.67 v26.42,26.42
  Bottom 0.406: v26.42,26.42 C16.1
ADC2  (via drill 0.7)
  Top 0.254: U1.15 28.75,40.44 28.45,40.13
  Top 0.406: 28.45,40.13 28.19,39.88 28.19,27.43 v28.7,26.92 | C15.1 PARAM2.2
  Bottom 0.406: v28.7,26.92 37.34,26.92 37.85,26.42 C15.1
DB4  (via drill 0.5)
  Top 0.254: U1.38 43.45,42.44 43.69,42.16 45.72,42.16 46.23,41.66 46.23,40.64 v46.99,39.88
  Bottom 0.254: v46.99,39.88 47.24,39.88 48.77,38.35 54.1,38.35 56.13,40.39 125.48,40.39 126.24,41.15 U$1.P$11
DB5  (via drill 0.5)
  Top 0.254: U1.39 43.7,42.94 43.94,42.67 47.75,42.67 48.51,41.91 48.51,40.13 v48.77,39.88
  Bottom 0.254: v48.77,39.88 48.77,39.62 49.53,38.86 53.85,38.86 55.88,40.89 122.94,40.89 123.7,41.66 U$1.P$12
DB6  (via drill 0.5)
  Top 0.254: U1.40 43.95,43.44 44.2,43.18 48.51,43.18 49.53,42.16 49.53,40.89 v50.55,39.88
  Bottom 0.254: v50.55,39.88 51.05,39.37 53.59,39.37 55.63,41.4 120.4,41.4 121.16,42.16 U$1.P$13
DB7  (via drill 0.5)
  Top 0.254: U1.41 44.19,43.94 44.45,43.69 48.77,43.69 v52.07,40.39
  Bottom 0.254: v52.07,40.39 52.58,39.88 53.34,39.88 55.37,41.91 117.86,41.91 118.62,42.67 U$1.P$14
DC  (via drill 0.5)
  Top 0.254: U1.34 42.11,40.44 42.42,40.13 42.42,38.86 44.45,36.83 v47.24,36.83
  Bottom 0.254: v47.24,36.83 54.86,36.83 56.9,38.86 143.51,38.86 144.02,39.37 U$1.P$4
DRYL  (via drill 0.7)
  Top 0.406: v91.19,84.07 R10.2 | DRY.6 166.12,67.31 v165.61,68.07 | v122.94,68.58 122.94,83.06 121.92,84.07 IC2.1
  Bottom 0.406: v91.19,84.07 91.44,84.58 C27.1 116.84,84.58 R25.1 IC2.1 | v165.61,68.07 123.44,68.07 v122.94,68.58
DRYR  (via drill 0.7)
  Top 0.406: R26.1 132.08,82.55 133.6,84.07 C26.1 | v125.98,66.8 125.98,81.03 126.49,81.53 IC2.7 | DRY.3 165.47,17.67 164.08,19.05 v164.08,59.94 | v153.42,60.45 153.42,65.79 v152.91,66.29
  Bottom 0.406: IC2.7 R26.1 | R11.2 125.48,66.29 v125.98,66.8 126.49,66.29 v152.91,66.29 | v164.08,59.94 153.92,59.94 v153.42,60.45
E  (via drill 0.5)
  Top 0.254: U1.36 42.64,41.44 43.43,40.64 43.43,39.37 43.94,38.86 v45.21,38.86
  Bottom 0.254: v45.21,38.86 47.5,38.86 48.51,37.85 54.36,37.85 56.39,39.88 138.43,39.88 138.94,40.39 U$1.P$6
FBL  (via drill 0.7)
  Top 0.406: v145.29,28.7 146.05,27.94 WET.6 | v92.96,28.7 92.96,22.1 91.95,21.08 R17.2
  Bottom 0.406: C22.- 75.95,21.84 76.45,22.35 FBL.1 85.09,20.57 85.6,20.07 89.66,20.07 R17.2 | v145.29,28.7 v92.96,28.7
FBR  (via drill 0.7)
  Top 0.406: v143.51,25.91 143.51,19.05 144.78,17.78 146.74,17.78 WET.3
  Bottom 0.406: 95.25,25.91 94.74,26.42 76.96,26.42 C21.- | v143.51,25.91 143.26,26.16 114.55,26.16 113.79,25.4 113.79,24.38 FBR.1 111.25,26.42 95.76,26.42 95.25,25.91 | R15.2 95.25,25.91
GND  (via drill 0.5, 0.7)
  other vias: 135.13,46.48 135.13,55.63 130.05,55.63 129.79,46.48 148.84,51.05 152.91,40.89 109.47,50.04 116.08,47.5 117.86,34.04 122.43,63.25 140.97,70.87 143.76,78.49 182.37,60.71 183.39,25.4 183.64,14.22 99.06,7.87 120.14,7.62 139.7,7.87 159.51,7.37 93.47,19.81 60.45,22.1 47.5,23.11 29.72,18.8 27.69,10.67 35.31,69.6 60.71,68.58 105.16,76.2 81.03,94.23 84.84,86.11 50.04,84.84 51.05,105.66 15.49,58.93 3.05,86.61 10.16,15.24 13.46,35.31 18.8,35.81 19.56,44.7 77.72,46.74 67.56,56.39 62.48,61.98 68.07,68.33 91.19,62.48 79.5,60.45 82.55,24.38 92.96,36.58 93.47,44.7 85.09,47.75 81.28,102.11 133.6,104.65 184.15,100.33 32.77,45.21 35.56,42.93 39.37,43.69 52.58,30.99 105.16,82.3 104.9,86.36 98.81,82.3 98.81,76.2 77.72,76.96 90.17,73.66 182.37,69.85 171.7,68.33 157.99,82.8 143.51,87.12 25.65,94.23 167.64,40.64 159.51,29.97 152.91,29.97 134.11,33.53 95.25,55.12 101.85,36.58 58.17,52.07 32.77,105.66 43.18,92.46
  pour Top: -1.02,113.79 191.26,113.79 191.01,-1.27 -1.27,-1.27
  pour Bottom: -2.79,117.09 194.82,117.09 194.82,-4.57 -2.79,-4.57
LIN
  Top 0.406: U2.20 61.94,53.55 65.02,56.64 65.02,60.2 67.06,62.23 C18.+
LOUT  (via drill 0.7)
  Top 0.406: U2.12 63.88,35.18 61.72,33.02 v61.72,25.15
  Bottom 0.406: v61.72,25.15 62.23,24.64 68.07,24.64 70.1,22.61 70.1,21.08 72.64,19.56 C22.+
LRCLK  (via drill 0.5, 0.7)
  Top 0.254: U1.33 41.34,39.94 41.4,39.62 | 60.71,38.21 U2.7
  Top 0.406: 41.4,39.62 v41.4,36.07 41.57,35.9 R34.1 | v61.47,35.31 61.47,36.32 60.63,37.16 U2.7 60.63,39.44 60.2,39.88 59.69,39.88 59.34,39.52 U2.5
  Bottom 0.406: v41.4,36.07 42.16,35.31 v61.47,35.31
MCLK
  Top 0.406: U2.25 58.69,47.74 57.4,49.02 55.12,49.02 54.61,48.51 51.9,48.51 R33.1 R49.2
MCLK2  (via drill 0.5)
  Top 0.254: U1.37 43.15,41.94 44.45,40.64 v44.7,40.64
  Bottom 0.406: v44.7,40.64 45.47,40.64 46.48,41.66 52.83,41.66 54.61,43.43 58.17,43.43 58.93,44.2 58.93,50.04 63.5,54.61 63.5,58.17 61.98,59.69 58.93,59.69 57.4,61.21 MCLK2.1
MIDIIN  (via drill 0.7)
  Top 0.406: v64.77,65.28 64.77,84.07 65.28,84.58 OK1.6 66.8,84.84 67.56,84.84 69.85,87.12 R3.2 | v26.16,65.28 R42.1
  Bottom 0.406: v26.16,65.28 v64.77,65.28
MISO  (via drill 0.5, 0.7)
  Top 0.254: U1.10 27.7,42.94 v26.92,42.93 26.16,42.93 | 59.98,33.31 v59.94,32.77
  Top 0.406: U2.6 59.98,33.31 | 26.16,42.93 23.37,40.13 v23.37,35.05 R40.1
  Bottom 0.406: v59.94,32.77 37.85,32.77 35.31,34.29 32,34.29 31.24,35.05 v23.37,35.05
MOSI  (via drill 0.7)
  Top 0.254: U1.11 28.72,42.44 26.67,41.4
  Top 0.406: 26.67,41.4 24.89,39.88 v24.89,29.21 24.89,27.94 24.73,27.52 R41.1 | U2.4 58.69,33.54 57.66,32.51 57.66,29.46 v57.15,28.96
  Bottom 0.254: 25.15,28.96 v24.89,29.21
  Bottom 0.406: v57.15,28.96 25.15,28.96
N$1
  Top 0.254: U1.31 38.81,33.73 38.1,33.02
  Top 0.406: 38.1,33.02 C4.+
N$2
  Top 0.254: U1.47 42.87,46.94 43.43,47.24
  Top 0.406: C5.+ 45.21,48.26 43.43,47.24
N$3
  Top 0.813: D2.A 35.05,98.55 34.04,99.57 R1.1
N$4
  Top 0.813: U4.2 11.1,92.63 D1.C
  Bottom 0.813: L1.2 15.49,90.93 13.72,92.71 D1.C
N$5
  Top 0.406: U2.14 65.19,36.67 R4.1
  Bottom 0.406: R4.1 68.07,36.83 C1.1 C10.+
N$6
  Bottom 0.813: U$2.P$3 36.96,100.46 R1.2
N$7  (via drill 0.7)
  Top 0.254: U1.60 33.81,50.52 33.27,51.05
  Top 0.406: 33.27,51.05 v32.77,51.56 | v28.96,51.82 R5.1
  Bottom 0.406: v32.77,51.56 29.21,51.56
  Bottom 0.61: 29.21,51.56 v28.96,51.82
N$8  (via drill 0.5, 0.7)
  Top 0.254: U1.42 49.52,44.44 v50.04,44.96
  Top 0.406: v24.13,53.09 24.13,50.29 v24.38,50.04
  Bottom 0.406: TX.1 23.88,53.34 v24.13,53.09 | v50.04,44.96 50.04,48.51 49.53,49.02 25.15,49.02 24.38,49.78 v24.38,50.04
N$9  (via drill 0.7)
  Top 0.254: U1.21 33.81,36.6 33.78,36.58
  Top 0.406: 33.78,36.58 v30.48,33.27
  Bottom 0.406: v30.48,33.27 8.64,33.27 7.62,32.26 LED1.A
N$10
  Top 0.406: R8.2 LED1.K
N$11
  Top 0.813: POWER.K R9.2
N$12
  Top 0.254: U1.6 23.35,44.94 22.86,44.45
  Top 0.406: 22.86,44.45 19.81,41.49 C13.1 | X1.P$2 17.09,40.21 17.53,40.64 19.72,40.64
  Top 0.61: 19.72,40.64 C13.1
N$13
  Top 0.254: U1.5 22.63,45.44 22.44,45.63
  Top 0.406: 16.84,49.71 17.53,49.02 19.65,49.02 | C14.1 19.81,48.26 22.44,45.63
  Top 0.61: X1.P$1 16.84,49.71 | 19.65,49.02 C14.1
N$14  (via drill 0.7)
  Top 0.406: v139.45,16 139.45,32.51 v139.7,32.77 | v169.16,33.27 169.16,63.25 v168.66,63.75 | v135.89,64.26 R30.2
  Bottom 0.406: FB.2 129.54,16.51 130.56,15.49 138.94,15.49 v139.45,16 | v139.7,32.77 168.66,32.77 v169.16,33.27 | v168.66,63.75 136.4,63.75 v135.89,64.26
N$15  (via drill 0.7)
  Top 0.406: v76.45,63.75 76.45,55.88 C17.-
  Bottom 0.406: R11.1 R12.2 83.31,63.75 C19.1 v76.45,63.75
N$16  (via drill 0.7)
  Top 0.406: FB.5 129.54,29.97 v129.03,30.48 | v97.03,30.73 97.03,67.31 v97.79,68.07 | v116.59,68.58 R27.2
  Bottom 0.406: v129.03,30.48 97.28,30.48 v97.03,30.73 | v97.79,68.07 116.08,68.07 v116.59,68.58
N$17  (via drill 0.7)
  Top 0.406: C18.- 73.66,73.91 v74.17,74.42
  Bottom 0.406: v74.17,74.42 C20.1 84.33,76.96 R13.2 R10.1
N$18
  Top 0.406: C29.1 R16.2 | R7.2 161.8,76.45 R23.1
  Bottom 0.406: IC1.2 R23.1 161.04,76.2 160.53,75.69 156.46,75.69 C29.1
N$19
  Top 0.406: C28.1 R14.2 | R6.2 175.77,24.38 177.29,25.91 177.29,70.36 174.75,72.9 R21.1
  Bottom 0.406: IC1.6 173.99,74.68 174.5,74.17 R21.1 176.78,76.2 179.32,76.2 180.34,77.22 C28.1
N$20
  Top 0.813: R18.2 R19.1
  Bottom 0.813: R19.1 C23.1 42.42,83.31 43.43,82.3 IC3.3
N$21  (via drill 0.7)
  Top 0.406: v156.72,16 156.72,65.53 v157.23,66.04 | v187.2,66.8 187.2,83.82 v186.94,84.07
  Bottom 0.406: WET.2 148.59,16.51 149.35,15.75 156.46,15.75 v156.72,16 | v157.23,66.04 186.69,66.04 v187.2,66.8 | v186.94,84.07 R14.1
N$22
  Top 0.406: WET.5 148.59,43.18 155.45,50.04 R16.1
N$23  (via drill 0.7)
  Top 0.406: R21.2 R36.2 177.29,86.11 v176.78,86.61
  Bottom 0.406: C28.2 178.05,73.41 R21.2 | v176.78,86.61 165.86,86.61 165.35,87.12 C34.+
N$24  (via drill 0.7)
  Top 0.406: R23.2 R35.2 | v140.97,81.79 140.46,82.3 140.46,88.14 136.65,91.95 C35.+
  Bottom 0.406: R35.2 156.21,80.77 C29.2 v140.97,81.79
N$25  (via drill 0.5, 0.7)
  Top 0.254: U1.17 30.65,38.02
  Top 0.406: 30.65,38.02 v29.97,37.34 | v51.82,43.18 R49.1
  Bottom 0.254: 38.86,37.85 38.86,38.1
  Bottom 0.406: v29.97,37.34 29.97,36.58 30.23,36.32 34.8,36.32 36.32,37.85 38.86,37.85 | 38.86,38.1 43.94,43.18 v51.82,43.18
N$26  (via drill 0.7)
  Top 0.406: C24.+ 99.31,72.39 v100.08,73.15
  Bottom 0.406: v100.08,73.15 R28.2
N$27
  Top 0.406: C27.2 113.54,76.2 R28.1
  Bottom 0.406: IC2.2 R25.2 115.57,81.53 C27.2 | R27.1 R28.1
N$28
  Top 0.406: C26.2 135.64,75.44 R30.1
  Bottom 0.406: C26.2 R26.2 IC2.6 | R29.1 R30.1
N$29
  Top 0.406: IN.3 107.05,17.67 104.14,20.57 104.14,42.93 101.6,45.47 101.6,88.39 INR.P$4
  Bottom 0.406: INL.P$1 INR.P$4
N$30  (via drill 0.7)
  Top 0.406: C25.+ 120.9,36.32 v121.41,36.83 | v159.51,37.34 159.51,61.72 v159,62.23 | v132.33,62.74 R29.2
  Bottom 0.406: v121.41,36.83 159,36.83 v159.51,37.34 | v159,62.23 132.84,62.23 v132.33,62.74
N$31
  Bottom 0.406: R36.1 172.47,77.72 IC1.7
N$32
  Bottom 0.406: IC1.1 162.05,79.76 R35.1
N$33  (via drill 0.7)
  Top 0.406: IN.5 110.49,23.62 v109.98,24.13 | v101.85,23.88 C24.-
  Bottom 0.406: v109.98,24.13 102.11,24.13 v101.85,23.88
N$34
  Bottom 0.406: C25.- 118.36,17.02 117.09,15.75 111.25,15.75 110.49,16.51 IN.2
N$35
  Bottom 0.406: DRY.2 168.66,16.51 169.67,15.49 174.5,15.49 175.51,16.51 R6.1
N$36
  Bottom 0.406: DRY.5 168.66,21.34 167.64,22.35 164.34,22.35 R7.1
N$37
  Bottom 0.813: J1.1 15.75,108.97 17.02,110.24 34.54,110.24 39.12,105.66 39.12,104.39 39.88,103.63 U$2.P$1
N$38
  Bottom 0.406: R22.2 69.85,84.58 67.56,86.87 66.8,86.87 OK1.7
N$39
  Top 0.406: R2.1 D4.C
  Bottom 0.406: OK1.2 56.13,87.12 55.12,88.14 D4.C
N$40
  Bottom 0.406: MIDI.4 55.63,96.52 R2.2
N$41  (via drill 0.7)
  Top 0.406: v62.48,93.47 62.48,86.87 60.2,84.58 59.69,84.58 59.44,84.84 59.18,84.84 OK1.3
  Bottom 0.406: OK1.3 57.4,84.58 D4.A | MIDI.5 71.37,95.25 70.36,94.23 63.25,94.23 v62.48,93.47
N$42
  Top 0.406: R32.2 104.9,60.71 105.92,59.69 U$1.P$19
N$43
  Top 0.406: R31.2 U$1.P$18
N$44
  Top 0.406: R24.2 112.01,60.71 111,59.69 U$1.P$17
N$45
  Top 0.406: R33.2 51.82,55.88 52.32,56.39 52.32,58.42 54.86,60.96 MCLK.1
N$46
  Top 0.406: LRCLK.1 45.89,31.24 R34.2
N$47
  Top 0.406: R39.2 34.46,34.2 SCLK.1
N$48
  Top 0.406: R40.2 23.37,29.46 21.84,27.94 MISO.1
N$49
  Top 0.406: R41.2 24.64,24.13 25.4,23.37 MOSI.1
N$50  (via drill 0.5, 0.7)
  Top 0.254: U1.43 47.73,44.94 v48.51,45.72
  Top 0.406: v22.61,48.01 22.61,55.63 v22.35,55.88 22.35,64.01 R42.2
  Bottom 0.254: 22.86,47.75 v22.61,48.01
  Bottom 0.406: v48.51,45.72 48.51,47.24 48.01,47.75 22.86,47.75 | v22.35,55.88 RX.1
N$51
  Bottom 0.406: U$3.SW1 58.67,18.54 R45.1
N$52
  Bottom 0.406: R46.1 83.31,19.3 U$4.SW1
N$53
  Top 0.406: R20.2 C35.-
  Bottom 0.406: OUTL.P$4 136.4,95.76 C35.-
N$54
  Top 0.406: R47.2 147.32,83.82 150.62,87.12 C34.- 158.75,89.15 162.81,93.22 OUTR.P$4
N$55  (via drill 0.7)
  Top 0.406: FB.6 127,31.75 v126.49,32.26 | v87.63,32 FBL1.1
  Bottom 0.406: v126.49,32.26 87.88,32.26 v87.63,32
N$56  (via drill 0.7)
  Top 0.406: FB.3 125.84,17.67 124.97,18.54 124.97,23.88 v124.71,24.13
  Bottom 0.406: v124.71,24.13 FBR1.1
N$57
  Top 0.406: U2.16 64.53,47.77 65.02,48.26 C37.+ 67.31,45.97 68.33,44.96 C36.1
N$58  (via drill 0.7)
  Top 0.406: IN.6 107.82,20.19 105.66,22.35 105.66,46.99 v105.16,47.5 | v93.73,48.01 93.73,94.74 v93.22,95.25
  Bottom 0.406: v105.16,47.5 94.23,47.5 v93.73,48.01 | v93.22,95.25 86.87,95.25 INL.P$4 86.36,97.79 87.38,98.81 123.44,98.81 125.22,97.03 INR.P$1
N$59
  Top 0.406: U$1.P$3 R48.2
N$60
  Bottom 0.813: IC3.7 IC3.6
NRESET  (via drill 0.7)
  Top 0.254: U1.7 26.15,44.44 24.64,43.43
  Top 0.406: 24.64,43.43 21.59,40.39 21.59,29.97 v21.34,29.72 | 9.87,31.5 RESET.2 9.92,35.31 11.18,35.31 12.19,36.32 12.19,48.51 10.41,50.29 STLINK.5 | 9.87,31.5 9.87,30.52 v11.18,29.21 | C12.2 10.12,31.75 9.87,31.5
  Bottom 0.406: v21.34,29.72 11.68,29.72 v11.18,29.21
  Bottom 0.61: RESET.2 RESET.1
PE
  Bottom 0.406: MIDI.PE@ MIDI.PE
RIN
  Top 0.406: U2.19 62.59,48.62 67.06,53.09 C17.+
ROUT  (via drill 0.7)
  Top 0.406: U2.13 64.53,34.31 63.25,32.77 v63.25,27.69
  Bottom 0.406: v63.25,27.69 63.5,27.43 C21.+
RW  (via drill 0.5)
  Top 0.254: U1.35 42.37,40.94 42.93,40.39 42.93,39.12 44.2,37.85 v46.23,37.85
  Bottom 0.254: v46.23,37.85 47.75,37.85 48.26,37.34 54.61,37.34 56.64,39.37 140.97,39.37 141.48,39.88 U$1.P$5
SCL  (via drill 0.7)
  Top 0.254: U1.58 34.81,50.81 35.05,51.05 | 59.34,48.87 57.91,50.29 56.13,50.29 55.63,50.8 v55.63,52.58
  Top 0.406: R37.1 36.32,52.83 | 36.32,52.83 35.05,51.05 | U2.24 59.34,48.87 | 36.32,52.83 v37.85,52.83
  Bottom 0.406: v37.85,52.83 55.37,52.83 v55.63,52.58
SCLK  (via drill 0.5, 0.7)
  Top 0.254: U1.29 37.81,37.05 36.83,36.07
  Top 0.406: 36.83,36.07 v36.83,35.81 36.83,35.56 36.49,35.9 R39.1 | U2.3 58.03,36.7 57.15,35.81 v57.15,34.04
  Bottom 0.406: v57.15,34.04 38.61,34.04 v36.83,35.81
SDA  (via drill 0.7)
  Top 0.254: U1.59 34.31,52.3 34.04,52.58
  Top 0.406: 32.77,53.85 33.91,52.7 | 33.91,52.7 34.04,52.58 | U2.23 59.98,53.81 v59.69,54.36 | v34.54,53.34 33.91,52.7
  Top 0.61: R38.1 32.77,53.85
  Bottom 0.406: v59.69,54.36 35.56,54.36 v34.54,53.34
SWCLK  (via drill 0.7)
  Top 0.254: v41.66,50.55 39.62,50.55 39.37,50.29 39.37,49.42 U1.49
  Top 0.406: v49.02,57.15 49.02,51.05 v48.77,50.8
  Bottom 0.406: v41.66,50.55 48.51,50.55 v48.77,50.8 | STLINK.2 48.26,57.91 v49.02,57.15
SWDIO  (via drill 0.7)
  Top 0.254: U1.46 44.24,46.44
  Top 0.406: 44.24,46.44 47.2,46.44 50.29,49.53 50.29,56.13 50.8,56.64 v50.8,61.72 | STLINK.4 10.67,52.83 12.19,54.36 12.19,66.29 v12.7,67.06 | v46.48,67.06 v46.48,62.48
  Bottom 0.406: v50.8,61.72 47.24,61.72 v46.48,62.48 | v12.7,67.06 v46.48,67.06
SWITCH1  (via drill 0.7)
  Top 0.254: U1.2 28.75,46.94 28.19,47.5
  Top 0.406: 28.19,47.5 27.43,48.26 27.43,60.71 27.69,60.96 v27.69,68.83 | v2.54,8.89 1.78,9.65 1.78,67.82 v2.29,68.33 | v50.55,3.56 R43.1 51.82,13.72 52.32,14.22 R45.2
  Bottom 0.406: v27.69,68.83 2.79,68.83 v2.29,68.33 | v2.54,8.89 6.35,8.89 11.68,3.56 v50.55,3.56 | R43.1 C32.1
SWITCH2  (via drill 0.7)
  Top 0.254: U1.3 27.48,46.44
  Top 0.406: 27.48,46.44 26.16,47.75 v26.16,61.98 | v3.05,61.72 3.3,11.43 v4.06,10.67 | v72.14,5.33 72.14,11.68 73.15,12.7 R44.1
  Bottom 0.406: v3.05,61.72 3.81,62.48 25.4,62.48 25.91,61.98 v26.16,61.98 | v4.06,10.67 7.11,10.67 12.45,5.33 v72.14,5.33 75.95,5.33 76.96,6.35 C33.1 | R44.1 74.68,13.46 75.44,13.46 79.5,19.56 R46.2
SWO  (via drill 0.7)
  Top 0.254: U1.55 36.31,50.53 36.83,51.05 39.62,51.05 41.4,52.83 41.4,54.1
  Top 0.406: 41.4,54.1 41.4,61.21 v41.91,61.72 | v5.08,64.01 5.08,48.51 5.84,47.75 STLINK.6
  Bottom 0.406: v41.91,61.72 41.91,63.25 41.15,64.01 v5.08,64.01

### Text on the board
tPlace: 3.3v | in L | in R | out L | out R | DSP development board | March 2021 MSL | LM3575-3.3 | 1 | wm8731 | 8MHz | stm32 | NHD-0420 | github.com/dallegre/reverbboard | User1 | User2